# EAGLE schematic Variac output (EAGLE 9.4.1)
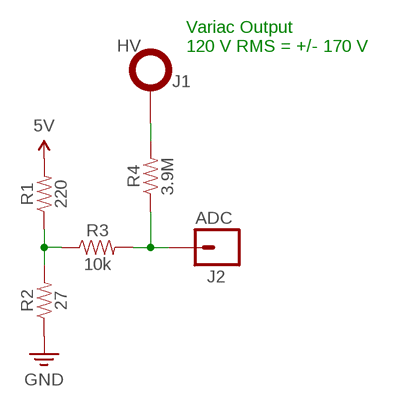
[diagram p0: schematic, sheet 1]

## Parts
J1  HV  TERMINAL_M6  [LUG_SQUARE_M6]
J2  ADC  CONN_01PTH_2MM  [1X01_2MM]
R1  220  15KOHM-HORIZ-1/4W-5%  [AXIAL-0.3]
R2  27  15KOHM-HORIZ-1/4W-5%  [AXIAL-0.3]
R3  10k  15KOHM-HORIZ-1/4W-5%  [AXIAL-0.3]
R4  3.9M  15KOHM-HORIZ-1/4W-5%  [AXIAL-0.3]

## Nets
3.3V: R2.P$1 ; supply symbol labelled GND
5V: R1.P$2
N$1: J1.P$1 R4.P$2
N$3: R1.P$1 R2.P$2 R3.P$1
N$4: J2.1 R3.P$2 R4.P$1

## Notes on the sheet
- Variac Output
  120 V RMS = +/- 170 V

## Library data of the parts
J1 = cwParts:TERMINAL_M6: Attachment for an M6 terminal
J2 = SparkFun-Connectors:CONN_01: Single connection point. Often used as Generic Header-pin footprint for 0.1 inch spaced/style header connections On any of the 0.1 inch spaced packages, you can populate with these: Break Away Headers - Straight <https://www.sparkfun.com/products/116> (PRT-00116) Break Away Male Headers - Right Angle <https://www.sparkfun.com/products/553> (PRT-00553) Female Headers <https://www.sparkfun.com/products/115> (PRT-00115) Break Away Headers - Machine Pin <https://www.sparkfun.com/products/117> (PRT-00117) Break Away Female Headers - Swiss Machine Pin <https://www.sparkfun.com/products/743> (PRT-00743) This device is also useful as a general connection point to wire up your design to another part of your project. Our various solder wires solder well into these plated through hole pads. Hook-Up Wire - Assortment (Stranded, 22 AWG) <https://www.sparkfun.com/products/11375> (PRT-11375) Hook-Up Wire - Assortment (Solid Core, 22 AWG) <https://www.sparkfun.com/products/11367> (PRT-11367) View the entire wire category on our website here <https://www.sparkfun.com/categories/141> Special notes: SMTSO-256-ET is a "flush mount" nut for a 4-40 screw. We mostly use this on specialty testbeds; it is a nice way to connect hardware to your PCB at an adjustable hieght. Also note, the SNAP packages are for using a snappable style connector. We sell a baggie of snaps and they are also used on two LilyPad designs: Snap Assortment - 30 pack (male and female) <https://www.sparkfun.com/products/11347> (DEV-11347) LilyPad Arduino SimpleSnap <https://www.sparkfun.com/products/10941> (DEV-10941) LilyPad SimpleSnap Protoboard <https://www.sparkfun.com/products/10940> (DEV-10940)
R1-R4 = SparkFun-Resistors:15KOHM: 15kΩ resistor A resistor is a passive two-terminal electrical component that implements electrical resistance as a circuit element. Resistors act to reduce current flow, and, at the same time, act to lower voltage levels within circuits. - Wikipedia; PROD_ID: RES-11360; VALUE: 15k